# Altium schematic sheet RS_485_MAX3352_TXLED.SchDoc: Device Control Port
size A4; Organization: Altium Limited.; Address1: Level 3, 12a Rodborough Rd; Address2: Frenchs Forest 2086; Address3: NSW; Address4: AUSTRALIA; DocumentNumber: 1; Revision: 6; SheetNumber: 1; SheetTotal: 2
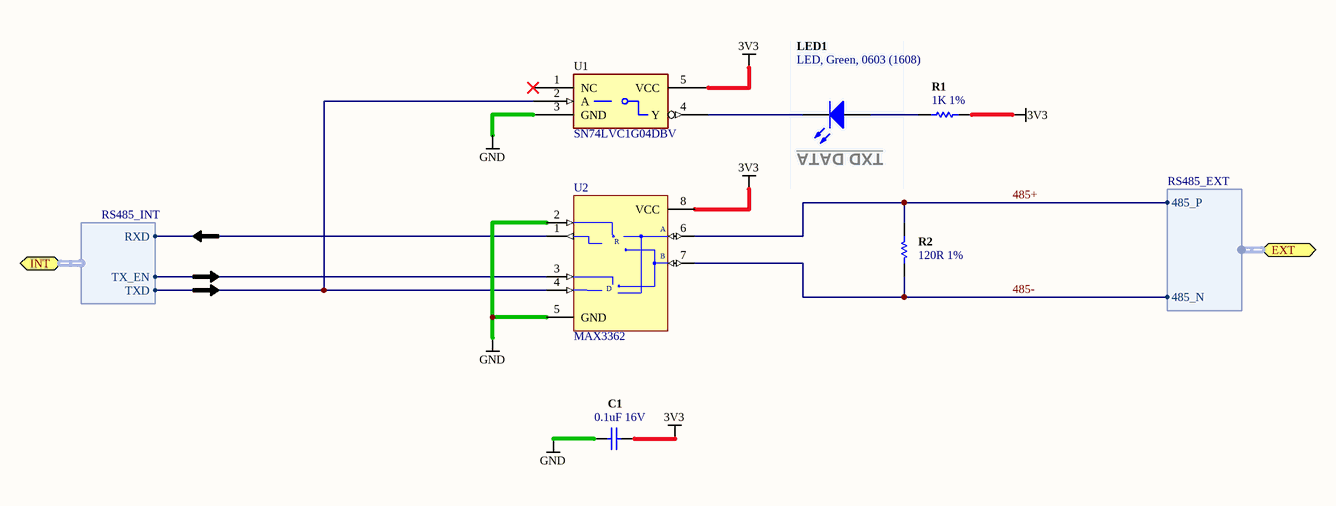
[diagram p0: RS_485_MAX3352_TXLED.SchDoc]

## Parts
C1  0.1uF 16V  [CAPC1005-STAR]
LED1  LED, Green, 0603 (1608)  [0603LED]
R1  1K 1%  [RESC1005-STAR]
R2  120R 1%  [RESC1005-STAR]
U1  SN74LVC1G04DBV  [SOT95P280-5]
U2  MAX3362  [SOT23-8]

## Blocks framed on the sheet
TXD DATA: LED1

## Ports
EXT (harness RS485_EXT), INT (harness RS485_INT)

## Harnesses
RS485_EXT: 485_P, 485_N
RS485_INT: RXD, TX_EN, TXD

## Nets
3V3: C1.1 R1.1 U1.5(VCC) U2.8(VCC)
GND: C1.2 U1.3(GND) U2.2(~{RE}) U2.5(GND)
485+: R2.2 U2.6(A) ; port EXT.485_P
485-: R2.1 U2.7(B) ; port EXT.485_N
NetLED1_1: LED1.1(A) R1.2
NetLED1_2: LED1.2(K) U1.4(Y)
NetU1_2: U1.2(A) U2.4(DI) ; port INT.TXD
NetU2_1: U2.1(RO) ; port INT.RXD
NetU2_3: U2.3(DE) ; port INT.TX_EN

Not connected (* = marked no-connect by the designer): U1 1(NC)*

## Notes on the sheet
- Sheet Title
- Project Title
- Size:
- Date:
- A4
- Assy:
- Time:
- Sheet
- Revision:
- of
- File:
- (in symbol D-221-0010) R; D

## Library data of the parts
C1 = D-101-0080: Capacitor, Ceramic, 0.1uF 10% 16V 0402 (1005) X7R; Polarity: Non-Polarized; Category: Capacitor; Capacitance: 0.1 uF; Dielectric: X7R; Mounting Technology: Surface Mount; Rated Voltage: 16 V; Status: Production; Technology: Ceramic; Tolerance: 10 %
LED1 = D-153-0002: Brightness: 50 mcd; Peak Wave Length: nm; Category: LED; Color: Green; Mounting Technology: Surface Mount; Status: Production
R1 = D-100-0121: Resistor, 1K 1% 0402 (1005); Power Rating: 63 mW; Category: Resistor; Mounting Technology: Surface Mount; Resistance: 1 K; Status: Production; Tolerance: 1 %
R2 = D-100-0126: Resistor, 120R 1% 0402 (1005); Power Rating: 63 mW; Category: Resistor; Mounting Technology: Surface Mount; Resistance: 120 R; Status: Production; Tolerance: 1 %
U1 = D-205-0001: SN74LVC1G04DBV, Single Inverter Gate, 1.65-V to 5.5-V; Mounting Technology: Surface Mount; Status: Production; Category: IC-Logic
U2 = D-221-0010: MAX3362 3.3V, High-Speed, RS-485/RS-422 Transceiver in  SOT Package; Comm Standard: None; Mounting Technology: Surface Mount; Status: Unreleased; Category: IC-Communication